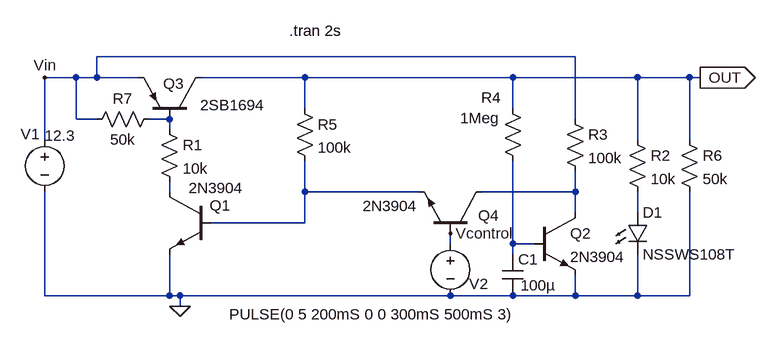
[diagram p0: schematic soft_latch_switch.asc]
soft_latch_switch.asc, the LTspice schematic file:
Version 4
SHEET 1 880 680
WIRE 352 -48 -384 -48
WIRE -416 -16 -464 -16
WIRE -384 -16 -384 -48
WIRE -384 -16 -416 -16
WIRE -320 -16 -384 -16
WIRE -64 -16 -224 -16
WIRE 256 -16 -64 -16
WIRE 448 -16 256 -16
WIRE 528 -16 448 -16
WIRE 544 -16 528 -16
WIRE -64 32 -64 -16
WIRE 256 32 256 -16
WIRE -416 48 -416 -16
WIRE -384 48 -416 48
WIRE -272 48 -304 48
WIRE 352 48 352 -48
WIRE -272 64 -272 48
WIRE -464 80 -464 -16
WIRE 448 80 448 -16
WIRE 528 80 528 -16
WIRE -272 160 -272 144
WIRE -64 160 -64 112
WIRE 112 160 -64 160
WIRE 352 160 352 128
WIRE 352 160 208 160
WIRE 352 192 352 160
WIRE 448 192 448 160
WIRE -64 208 -64 160
WIRE -64 208 -208 208
WIRE 160 240 160 224
WIRE 256 240 256 112
WIRE 288 240 256 240
WIRE 256 256 256 240
WIRE -464 320 -464 160
WIRE -272 320 -272 256
WIRE -272 320 -464 320
WIRE -256 320 -272 320
WIRE 160 320 -256 320
WIRE 256 320 160 320
WIRE 352 320 352 288
WIRE 352 320 256 320
WIRE 448 320 448 256
WIRE 448 320 352 320
WIRE 528 320 528 160
WIRE 528 320 448 320
WIRE -256 336 -256 320
FLAG -256 336 0
FLAG 544 -16 OUT
IOPIN 544 -16 Out
FLAG -464 -16 Vin
FLAG 160 224 Vcontrol
SYMBOL npn -208 160 M0
WINDOW 0 -30 21 Left 2
WINDOW 3 -50 -6 Left 2
SYMATTR InstName Q1
SYMATTR Value 2N3904
SYMBOL voltage -464 64 R0
WINDOW 0 -37 7 Left 2
WINDOW 123 0 0 Left 2
WINDOW 39 0 0 Left 2
WINDOW 3 0 9 Left 2
SYMATTR InstName V1
SYMATTR Value 12.3
SYMBOL voltage 160 224 R0
WINDOW 3 -340 125 Left 2
WINDOW 123 0 0 Left 2
WINDOW 39 0 0 Left 2
WINDOW 0 29 78 Left 2
SYMATTR Value PULSE(0 5 200mS 0 0 300mS 500mS 3)
SYMATTR InstName V2
SYMBOL res 336 32 R0
SYMATTR InstName R3
SYMATTR Value 100k
SYMBOL npn 288 192 R0
SYMATTR InstName Q2
SYMATTR Value 2N3904
SYMBOL res 240 16 R0
WINDOW 0 -33 -1 Left 2
WINDOW 3 -65 30 Left 2
SYMATTR InstName R4
SYMATTR Value 1Meg
SYMATTR SpiceLine tol=1 pwr=0.1
SYMBOL cap 240 256 R0
WINDOW 3 28 48 Left 2
SYMATTR Value 100µ
SYMATTR InstName C1
SYMBOL res -80 16 R0
SYMATTR InstName R5
SYMATTR Value 100k
SYMBOL pnp -224 48 M270
WINDOW 0 55 58 VLeft 2
WINDOW 3 22 1 VLeft 2
SYMATTR InstName Q3
SYMATTR Value 2SB1694
SYMBOL npn 208 224 M270
WINDOW 0 28 5 VLeft 2
WINDOW 3 42 183 VLeft 2
SYMATTR InstName Q4
SYMATTR Value 2N3904
SYMBOL res -288 48 R0
SYMATTR InstName R1
SYMATTR Value 10k
SYMBOL res 432 64 R0
SYMATTR InstName R2
SYMATTR Value 10k
SYMBOL LED 432 192 R0
SYMATTR InstName D1
SYMATTR Value NSSWS108T
SYMBOL res 512 64 R0
SYMATTR InstName R6
SYMATTR Value 50k
SYMBOL res -288 32 R90
WINDOW 0 0 56 VBottom 2
WINDOW 3 32 56 VTop 2
SYMATTR InstName R7
SYMATTR Value 50k
TEXT -88 -88 Left 2 !.tran 2s

The netlist it stands for:
* soft_latch_switch.asc
Q1 N002 N003 0 0 2N3904
V1 Vin 0 12.3
V2 Vcontrol 0 PULSE(0 5 200mS 0 0 300mS 500mS 3)
R3 Vin N004 100k
Q2 N004 N006 0 0 2N3904
R4 OUT N006 1Meg tol=1 pwr=0.1
C1 N006 0 100µ
R5 OUT N003 100k
Q3 OUT N001 Vin 0 2SB1694
Q4 N004 Vcontrol N003 0 2N3904
R1 N001 N002 10k
R2 OUT N005 10k
D1 N005 0 NSSWS108T
R6 OUT 0 50k
R7 N001 Vin 50k
.model D D
.lib standard.dio
.model NPN NPN
.model PNP PNP
.lib standard.bjt
.tran 2s
.backanno
.end